# Altium schematic sheet MainBoard_V100_CSP.SchDoc
size A4; SheetNumber: 11; SheetTotal: 22; Title_: Charge Sensitive Preamplifier
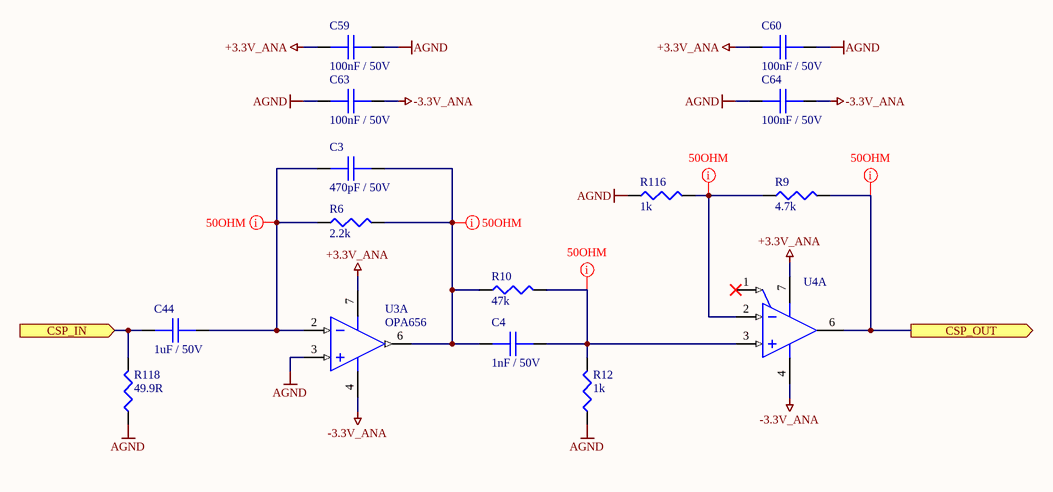
[diagram p0: MainBoard_V100_CSP.SchDoc]

## Parts
C3  470pF / 50V  [0805_C]
C4  1nF / 50V  [0805_C]
C44  1uF / 50V  [0805_C]
C59  100nF / 50V  [0805_C]
C60  100nF / 50V  [0805_C]
C63  100nF / 50V  [0805_C]
C64  100nF / 50V  [0805_C]
R6  2.2k  [0805]
R9  4.7k  [0805]
R10  47k  [0805]
R12  1k  [0805]
R116  1k  [0805]
R118  49.9R  [0805]
U3  OPA656  [SO-8]  (part A of 2)
U4  LT1806CS8#PBF  [SO-8]  (value not drawn)  (part A of 2)

## Ports
CSP_IN (in), CSP_OUT (out)

## Nets
+3.3V_ANA: C59.1 C60.1 U3.7(VS+) U4.7(V+)
-3.3V_ANA: C63.2 C64.2 U3.4(VS-) U4.4(V-)
AGND: C59.2 C60.2 C63.1 C64.1 R12.1 R116.1 R118.1 U3.3(IN+)
CSP_IN: C44.1 R118.2 ; port CSP_IN
CSP_OUT: R9.2 U4.6(OUT) ; port CSP_OUT
NetC3_1: C3.1 C4.1 R6.1 R10.1 U3.6(OUT)
NetC3_2: C3.2 C44.2 R6.2 U3.2(IN-)
NetC4_2: C4.2 R10.2 R12.2 U4.3(+IN)
NetR9_1: R9.1 R116.2 U4.2(-IN)

Not connected (* = marked no-connect by the designer): U4 1(~{SHDN})*

## Layout directives
net class 50R: CSP_OUT, NetC3_1, NetC3_2, NetC4_2, NetR9_1

## Notes on the sheet
- Board:
- Author:
- Title:
- Project:
- SVN:
- Version:
- Sheet:
- of
- Contact:
- Modified:
- Size:
- A4

## Library data of the parts
C3 = 143: 470 pF 50V X7R; Part Number: SMD0805-470pF-50V; Azonosító: 143; Category: Passives; Subcategory: PASS_Capacitor; Supplier 1: HESTORE; Supplier 1 order number: 100.011.35
C4 = 144: 1nF 50V X7R; Part Number: SMD0805-1nF-50V; Azonosító: 144; Category: Passives; Subcategory: PASS_Capacitor; Supplier 1: HESTORE; Supplier 1 order number: 100.200.70
C44 = 151: 1uF 50V X7R; Part Number: SMD0805-1uF-50V; Azonosító: 151; Category: Passives; Subcategory: PASS_Capacitor; Supplier 1: HESTORE; Supplier 1 order number: 100.330.68
C59 C60 C63 C64 = 149: 100nF 50V X7R; Part Number: SMD0805-100nF-50V; Azonosító: 149; Category: Passives; Subcategory: PASS_Capacitor; Supplier 1: HESTORE; Supplier 1 order number: 100.011.22
R6 = 54: 2.2k 0805 0.125W 5%; Part Number: SMD0805-2.2k 5%; Azonosító: 54; Category: Passives; Subcategory: PASS_Resistor; Supplier 1: HESTORE; Supplier 1 order number: 100.406.77
R9 = 56: 4.7k 0805 0.125W 5%; Part Number: SMD0805-4.7k 5%; Azonosító: 56; Category: Passives; Subcategory: PASS_Resistor; Supplier 1: HESTORE; Supplier 1 order number: 100.011.83
R10 = 63: 47k 0805 0.125W 5%; Part Number: SMD0805-47k 5%; Azonosító: 63; Category: Passives; Subcategory: PASS_Resistor; Supplier 1: HESTORE; Supplier 1 order number: 100.011.81
R12 R116 = 52: 1k 0805 0.125W 1%; Part Number: SMD0805-1k 1%; Azonosító: 52; Category: Passives; Subcategory: PASS_Resistor; Supplier 1: HESTORE; Supplier 1 order number: 100.312.99
R118 = 43: 49.9R 0805 0.125W 1%; Part Number: SMD0805-49.9R 1%; Azonosító: 43; Category: Passives; Subcategory: PASS_Resistor; Supplier 1: HESTORE; Supplier 1 order number: 100.317.46
U3 = 357: Wideband, Unity Gain Stable FET-Input Operational Amplifier, 10 to 12 V, -40 to 85 degC, 8-pin SOIC; PartNumber: OPA656U; Manufacturer: Texas Instruments; BW @ Acl(MHz): 500; Acl, min stable gain(V/V): 1; THD (Fc is 1 MHz)(Typ)(dB): -74; Io(Typ)(mA): 70; @ MHz: 5; Vn at Flatband(Typ)(nV/rtHz): 7; 3rd Harmonic(dBc): 100; Slew Rate(Typ)(V/us): 290; 2nd Harmonic(dBc): 74; Vs(Min)(V): 10; Vs(Max)(V): 12; Iib(Max)(nA): 0.02; Settling Time (0.1%)(Typ)(ns): 16; Vio(Max)(mV): 0.6; Diff Phase(deg): 0.05; Eco-Plan: Green (RoHS & no Sb/Br); Sub Family: High Output Current Amplifier (>=50mA), High Speed Amplifier (>=50MHz), Low Input Bias Current Amp (<=10pA); Azonosító: 357; ComponentLink1URL: http://www.ti.com/; ComponentLink2URL: http://www.ti.com/general/docs/lit/getliterature.tsp?genericPartNumber=OPA656&fileType=pdf; Mounting Technology: Surface Mount; Code_JEDEC: MS-012; PackageReference: D0008A; ComponentLink3URL: http://www.ti.com/litv/pdf/msoi002j; PackageVersion: 4040047-3/M, 06/2011; ComponentLink3Description: Package Specification; Number of Channels: 1; DatasheetVersion: SBOS196G; Iq per channel(Max)(mA): 16; ComponentLink2Description: Datasheet; ComponentLink1Description: Manufacturer URL; Diff Gain(%): 0.02; PackageDescription: 8-Pin Plastic Small Outline, Body 4.9 x 3.9 mm, Pitch 1.27 mm; Part Number: OPA656; Category: Integrated Circuits; Subcategory: IC_Analog; Supplier 1: MOUSER; Supplier 1 order number: 595-OPA656U; Supplier 2: DIGIKEY; Supplier 2 order number: OPA656U-ND; Help URL: https://www.ti.com/lit/ds/symlink/opa656.pdf?HQS=dis-mous-null-mousermode-dsf-pf-null-wwe&ts=1703783263659&ref_url=https%253A%252F%252Fhu.mouser.com%252F
U4 = 353: Single Channel, High Speed, Low Noise Precision Operational Amplifier, 325 MHz Typical GBW, 125 V/us Typical SR, 2.5 to 12.6 V, 8-Pin SOIC; Manufacturer: Linear Technology; Linear Technology Part Number: LT1806; Is (mA) Typical: 9; GBW (MHz) Typical: 325; SR (V/us) Typical: 125; Vos (mV) Guaranteed: 0.55; Vos (mV) Typical: 0.1; Vs Max (V): 12.6; Vs Min (V): 2.5; Channels (#): 1; Azonosító: 353; DatasheetVersion: Rev. C; ComponentLink3Description: Package Specification; Mounting Technology: Surface Mount; ComponentLink2Description: Datasheet; RevisionNote: URLs updated; PackageDescription: 8-Pin Plastic Small Outline, Body 4.9 x 3.9 mm, Pitch 1.27 mm; PackageVersion: Rev G; RoHS: Pb-Free; Type: VFB; PackageReference: LT-S8-8; ComponentLink2URL: http://cds.linear.com/docs/en/datasheet/18067fc.pdf; ComponentLink3URL: http://cds.linear.com/docs/en/packaging/05081610_G_SO8.pdf; PartNumber: LT1806CS8#PBF; ComponentLink1Description: Manufacturer URL; ComponentLink1URL: http://www.linear.com/; Part Number: LT1806CS8#PBF; Category: Integrated Circuits; Subcategory: IC_Analog; Supplier 1: MOUSER; Supplier 1 order number: 584-LT1806CS8#PBF; Help URL: https://hu.mouser.com/datasheet/2/609/18067fc-3124195.pdf